# Altium schematic sheet 5V_TO_3V_VD.SchDoc
size A4
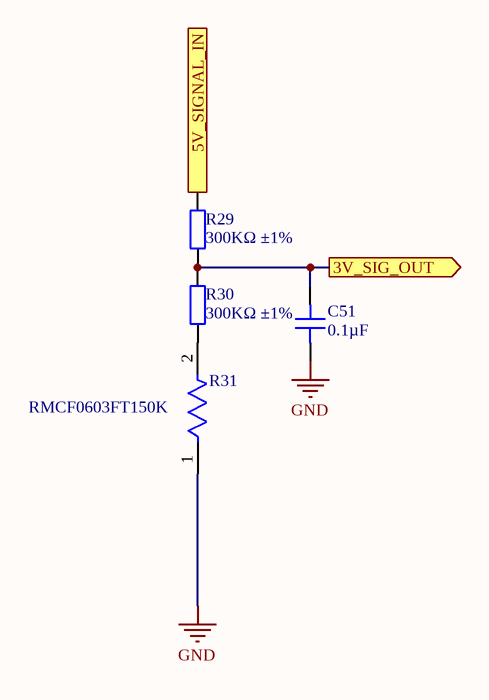
[diagram p0: 5V_TO_3V_VD.SchDoc]

## Parts
C51  0.1µF  [CAP 0402_1005]
R29  300KΩ ±1%  [0402_R]
R30  300KΩ ±1%  [0402_R]
R31  RMCF0603FT150K  [FP-RMCF0603-IPC_B]

## Ports
3V_SIG_OUT (out), 5V_SIGNAL_IN

## Nets
GND: C51.2 R31.1
3V_SIG_OUT: C51.1 R29.1 R30.2 ; port 3V_SIG_OUT
5V_SIGNAL_IN: R29.2 ; port 5V_SIGNAL_IN
NetR30_1: R30.1 R31.2

## Library data of the parts
C51 = C0402C104K4RECAUTO: CAP CER 0402 0.1UF 16V X7R 10%; Manufacturer: KEMET; Part Number: C0402C104K4RECAUTO; Value: 0.1µF; Applications: Automotive, ESD Protection; Capacitance: 0.1µF; ComponentLink1Description: Datasheet; ComponentLink1URL: https://api.kemet.com/component-edge/download/datasheet/C0402C104K4RECAUTO.pdf; ComponentLink2Description: DigiKey Link; ComponentLink2URL: http://digikey.com/product-detail/en/kemet/C0402C104K4RECAUTO/399-17167-1-ND/8563708; Device Package: 0402 (1005 Metric); LastUpdated: 2020-09-02 1:02:25 AM; Lifecycle Status: Active; Minimum Order: 1; Mounting Type: Surface Mount, MLCC; Operating Temperature: -55°C ~ 125°C; Package / Case: 0402 (1005 Metric); Packaging: TapeAndReel; PartId: 1731; Part Status: Active; Price: 0.02; Series: ESD SMD Auto X7R; Size / Dimension: 0.039" L x 0.020" W (1.00mm x 0.50mm); Supplier 1: DigiKey; Supplier Part Number 1: 399-17167-1-ND; Temperature Coefficient: X7R; Thickness (Max): 0.022" (0.55mm); Tolerance: ±10%; Voltage - Rated: 16V; Ratings: AEC-Q200
R29 R30 = 0402 300K (3003) 1%: Chip resistor; Manufacturer: Uniroyal Elec; PartNumber: 0402WGF3003TCE; Power: 1/16W; ComponentLink1Description: Supplier link; ComponentLink1URL: http://www.szlcsc.com/product/details_26517.html; Package: 0402; Supplier: LC; SuppliersPartNumber: C25774; Resistance: 300KΩ; Tolerance: 1%
R31 = CMP-26527-003138-1: 150kΩ ±1% 0.1W 0603 Thick Film Chip Resistor AEC-Q200 compliant; Temperature Coefficient: 100ppm/°C; Max Power Dissipation: 100mW; Resistance: 150kR; Construction: Rectangular; Width: 0.031inch; Length: 0.061inch; Tolerance: 1%; Case Code (Metric): 1608; Radiation Hardening: No; Number of Terminations: 2; Case/Package: 0603; Max Operating Temperature: 155°C; Case Code (Imperial): 0603; Depth: 0.8mm; Features: Automotive AEC-Q200; RoHS Compliant: Yes; Packaging: Tape and Reel; Height: 0.022inch; Contact Plating: Tin; Series: RMCF; Military Standard: Not; Size Code: 0603; Mount: Surface Mount; Min Operating Temperature: -55°C; Power Rating: 100mW; Resistor Type: Thick Film; Lead Free: Lead Free